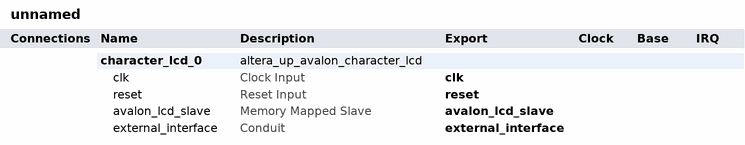
[diagram p0: system contents]
# Platform Designer (Qsys) system unnamed, Cyclone IV E EP4CE115F29C7
# Parameters at their usual value, and those the tool derives, are not listed.
package require -exact qsys 15.1
create_system unnamed
set_project_property DEVICE_FAMILY {Cyclone IV E}
set_project_property DEVICE EP4CE115F29C7

add_instance character_lcd_0 altera_up_avalon_character_lcd 15.1
set_instance_property character_lcd_0 AUTO_EXPORT true
set_instance_parameter_value character_lcd_0 cursor Blinking

# exported interfaces
add_interface avalon_lcd_slave avalon slave
set_interface_property avalon_lcd_slave EXPORT_OF character_lcd_0.avalon_lcd_slave
add_interface clk clock sink
set_interface_property clk EXPORT_OF character_lcd_0.clk
add_interface external_interface conduit end
set_interface_property external_interface EXPORT_OF character_lcd_0.external_interface
add_interface reset reset sink
set_interface_property reset EXPORT_OF character_lcd_0.reset

set_interconnect_requirement {$system} qsys_mm.clockCrossingAdapter HANDSHAKE
set_interconnect_requirement {$system} qsys_mm.enableEccProtection FALSE
set_interconnect_requirement {$system} qsys_mm.insertDefaultSlave FALSE
set_interconnect_requirement {$system} qsys_mm.maxAdditionalLatency 1

save_system unnamed.qsys
